# Altium project OSHChip_CMSIS_DAP_V1.0.PrjPCB
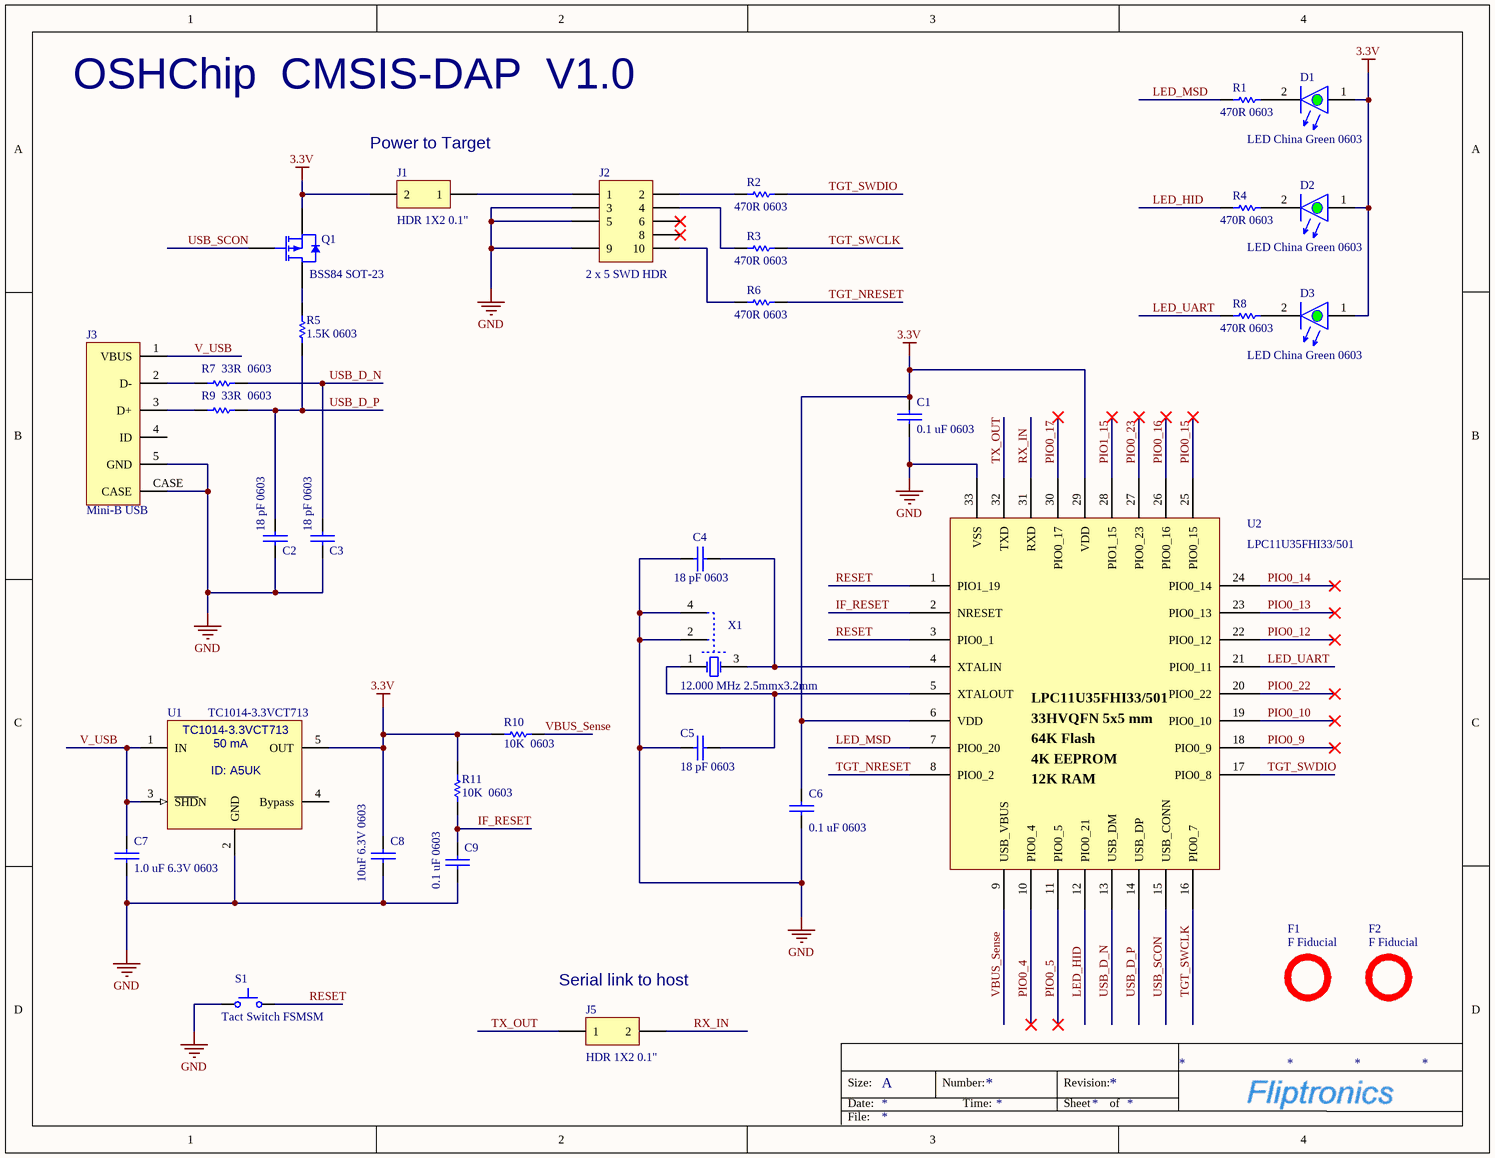
[diagram p0: OSHChip_CMSIS_DAP_V1.0.SchDoc]
Reference: OSHChip V1.0
1 sheet, 34 parts. Net scope: global (net labels, ports and power ports of the same name join across sheets).
Board file: OSHChip_CMSIS_DAP_V1.0.PcbDoc

## Sheet OSHChip_CMSIS_DAP_V1.0.SchDoc
size Letter; PageSetup: Record=PageOptions|CenterHorizontal=True|CenterVertical=True|PrintScale=1.07|XCorrection=1.00|YCorrection=1.00|PrintKind=1|BorderSize=5000000|LeftOffset=0|BottomOffset=0|Orientation=2|PaperLength=1000|PaperWidth=1000|Scale=100|PaperSource=260|PrintQuality=600|MediaType=1|DitherType=10|PaperKind=11x17|PrintScaleMode=0

### Parts
C1  0.1 uF 0603  [0603 Cap]
C2  18 pF 0603  [0603 Cap]
C3  18 pF 0603  [0603 Cap]
C4  18 pF 0603  [0603 Cap]
C5  18 pF 0603  [0603 Cap]
C6  0.1 uF 0603  [0603 Cap]
C7  1.0 uF 6.3V 0603  [0603 Cap]
C8  10uF 6.3V 0603  [0603 Cap]
C9  0.1 uF 0603  [0603 Cap]
D1  LED China Green 0603  [0603_LED]
D2  LED China Green 0603  [0603_LED]
D3  LED China Green 0603  [0603_LED]
F1  F Fiducial  [Fiducial Dot]  (no BOM)
F2  F Fiducial  [Fiducial Dot]  (no BOM)
J1  HDR 1X2 0.1"  [HDR_2X1_2MM54]
J2  2 x 5 SWD HDR  [HDR_2x5_1.27mm-Through_Hole_SWD No Shroud]
J3  Mini-B USB  [USB_Mini-B]
J5  HDR 1X2 0.1"  [HDR_2X1_2MM54]
Q1  BSS84 SOT-23  [SOT23-123]
R1  470R 0603  [0603 Res]
R2  470R 0603  [0603 Res]
R3  470R 0603  [0603 Res]
R4  470R 0603  [0603 Res]
R5  1.5K 0603  [0603 Res]
R6  470R 0603  [0603 Res]
R7  33R  0603  [0603 Res]
R8  470R 0603  [0603 Res]
R9  33R  0603  [0603 Res]
R10  10K  0603  [0603 Res]
R11  10K  0603  [0603 Res]
S1  Tact Switch FSMSM  [FSMSM Tact Switch]
U1  TC1014-3.3VCT713  [SOT23-5AL]
U2  LPC11U35FHI33/501  [LPC11U35 QFN32 footprint]
X1  12.000 MHz 2.5mmx3.2mm  [NX3225SA - High Density]

### Nets
3.3V: C1.2 C6.2 C8.2 D1.1 D2.1 D3.1 J1.2 Q1.2(S) R10.2 R11.2 U1.5(OUT) U2.6(VDD) U2.29(VDD)
GND: C1.1 C2.1 C3.1 C4.2 C5.2 C6.1 C7.1 C8.1 C9.1 J2.3 J2.5 J2.9 J3.5(GND) J3.CASE S1.1 U1.2(GND) U2.33(VSS) X1.2(nc_2) X1.4(nc_4)
IF_RESET: C9.2 R11.1 U2.2(NRESET)
LED_HID: R4.1 U2.12(PIO0_21)
LED_MSD: R1.1 U2.7(PIO0_20)
LED_UART: R8.1 U2.21(PIO0_11)
PIO0_4: U2.10(PIO0_4)
PIO0_5: U2.11(PIO0_5)
PIO0_9: U2.18(PIO0_9)
PIO0_10: U2.19(PIO0_10)
PIO0_12: U2.22(PIO0_12)
PIO0_13: U2.23(PIO0_13)
PIO0_14: U2.24(PIO0_14)
PIO0_15: U2.25(PIO0_15)
PIO0_16: U2.26(PIO0_16)
PIO0_17: U2.30(PIO0_17)
PIO0_22: U2.20(PIO0_22)
PIO0_23: U2.27(PIO0_23)
PIO1_15: U2.28(PIO1_15)
RESET: S1.2 U2.1(PIO1_19) U2.3(PIO0_1)
RX_IN: J5.2 U2.31(RXD)
TGT_NRESET: R6.2 U2.8(PIO0_2)
TGT_SWCLK: R3.2 U2.16(PIO0_7)
TGT_SWDIO: R2.2 U2.17(PIO0_8)
TX_OUT: J5.1 U2.32(TXD)
USB_D_N: C3.2 R7.2 U2.13(USB_DM)
USB_D_P: C2.2 R5.1 R9.2 U2.14(USB_DP)
USB_SCON: Q1.1(G) U2.15(USB_CONN)
V_USB: C7.2 J3.1(VBUS) U1.1(IN) U1.3(~{SHD}N)
VBUS_Sense: R10.1 U2.9(USB_VBUS)
NetC4_1: C4.1 U2.4(XTALIN) X1.3(OSC2)
NetC5_1: C5.1 U2.5(XTALOUT) X1.1(OSC1)
NetD1_2: D1.2 R1.2
NetD2_2: D2.2 R4.2
NetD3_2: D3.2 R8.2
NetJ1_1: J1.1 J2.1
NetJ2_2: J2.2 R2.1
NetJ2_4: J2.4 R3.1
NetJ2_10: J2.10 R6.1
NetJ3_2: J3.2(D-) R7.1
NetJ3_3: J3.3(D+) R9.1
NetQ1_3: Q1.3(D) R5.2

Not connected (* = marked no-connect by the designer): J2 6* 8*; J3 4(ID); U1 4(Bypass)

### Notes on the sheet
- OSHChip  CMSIS-DAP  V1.0
- (near J1) Power to Target
- (near J5) Serial link to host
- Size:
- Date:
- A
- Number:
- Time:
- Revision:
- Sheet
- of
- File:
- (in symbol U LPC11U35FHI33/501) 33HVQFN 5x5 mm; 64K Flash; 4K EEPROM; 12K RAM
- (in symbol U TC1014-3.3VCT713) 50 mA; ID: A5UK

### Library data of the parts
C1 C6 C9 = C 0.1 uF 16V 10% X7R 0603: 0.1 uF 16V 10% X7R 0603; Part Number: CC0603KRX7R7BB104; LatestRevisionDate: 06/29/2015; LatestRevisionNote: Created by PMF; Supplier 1: Digi-Key; Supplier Part Number 1: 311-1088-1-ND
C2-C5 = C 18 pF 0603  50V  NP0  5%: Capacitor 18 pF 0603  50V  NP0  5%; Part Number: CL10C180JB8NNNC; LatestRevisionDate: 06/29/2015; LatestRevisionNote: Created by PMF; Supplier 1: Digi-Key; Supplier Part Number 1: 1276-1089-1-ND
C7 = C 1.0 uF 6.3V 10% X7R 0603: Capacitor 1.0 uF 6.3V 10% X7R 0603; Part Number: CL10B105KQ8NNNC; LatestRevisionDate: 06/29/2015; LatestRevisionNote: Created by PMF; Supplier 1: Digi-Key; Supplier Part Number 1: 1276-1024-1-ND
C8 = C 10uF 0603 6.3V 20% X5R: Capacitor 10uF 0603 6.3V 20% X5R; Part Number: CL10A106MQ8NNNC; BOM Notes: < 100 pcs stock, check Verical for bulk.; LatestRevisionDate: 06/29/2015; LatestRevisionNote: Created by PMF; Supplier 1: Digi-Key; Supplier Part Number 1: 1276-1119-1-ND; Supplier 2: Digi-Key; Supplier Part Number 2: 490-6405-1-ND
D1-D3 = D LED LED_China_Green_0603: LED Green 0603; Part Number: ChinaLED_Green; BOM Notes: 'Check ebay, octoparts too. Parts from China at $0.014 each; LatestRevisionDate: 06/29/2015; LatestRevisionNote: Created by PMF; Supplier 1: China_ebay; Supplier Part Number 1: ChinaLED_Green
F1 F2 = F Fiducial: Fiducial; 1 MANUFACTURE A: Fliptronics; 1 MANUFACTURE A PART NUMBER: PCB_Artwork; 1 MANUFACTURE A WEBSITE: ~; 1 DISTRIBUTOR A: Fliptronics; 1 DISTRIBUTOR A ordering number: PCB_Artwork; 1 DISTRIBUTOR A price 1 off: 0.00; 1 DISTRIBUTOR A price 100 off: 0.00; LatestRevisionDate: 12/19/2011; LatestRevisionNote: Created by PMF; Publisher: Fliptronics; Supplier Part Number 1: PCB_Artwork; Supplier 1: Fliptronics
J1 J5 = J Header 1X2, 2.54 mm pitch: Header 1X2, 2.54 mm pitch; Part Number: M20-9990246; BOM Notes: Check Fliptronics stock. May require splitting longer strips.; LatestRevisionDate: 06/30/2015; LatestRevisionNote: Created by PMF; Supplier 1: Mouser; Supplier Part Number 1: 855-M20-9990246; Supplier 2: Newark; Supplier Part Number 2: 56K0146; Supplier 3: Digi-Key
J2 = J Header 5X2 J-Link Lite   FTSH-105-01-L-D through hole, No Key, No shroud: FTSH-105-01-L-D through hole, No Key, No shroud; BOM Notes: Check Fliptronics stock , equiv from China.; LatestRevisionDate: 06/30/2015; LatestRevisionNote: Created by PMF; Supplier 1: Newark; Supplier Part Number 1: 45P4907; Part Number: FTSH-105-01-L-D
J3 = J Mini-B USB 690-005-299-043 With alignment pins: USB 2.0, Right Angle, SMT, B Type, Receptacle, 5 Position, Black; BOM Notes: Part number is a place holder. Sourcing these via AliExpress.; LatestRevisionDate: 06/30/2015; LatestRevisionNote: Created by PMF; Supplier 1: Digi-Key; Supplier Part Number 1: 151-1206-1-ND; Part Number: 690-005-299-043
Q1 = Q BSS84: P-channel Enhancement Mode Vertical D-MOSFET; Part Number: BSS84,215; LatestRevisionDate: 06/30/2015; LatestRevisionNote: From Fairchild Lib; Supplier 1: Mouser; Supplier Part Number 1: 771-BSS84-T/R
R1-R4 R6 R8 = R 470R 0603 1/10 W 1%: Resistor 470R 0603 1/10 W 1%; Part Number: RC1608F471CS; LatestRevisionDate: 06/30/2015; LatestRevisionNote: Created by PMF; Supplier 1: Digi-Key; Supplier Part Number 1: 1276-4619-1-ND
R5 = R 1.5K 0603 1/10 W 1%: Resistor 1.5K 0402 1/10 W 1%; Part Number: RC0603FR-071K5L; LatestRevisionDate: 06/29/2015; LatestRevisionNote: Created by PMF; Supplier 1: Mouser; Supplier Part Number 1: 603-RC0603FR-071K5L; Supplier 2: Digi-Key; Supplier Part Number 2: 311-1.50KHRTR-ND
R7 R9 = R 33R 0603 1/10 W 1%: Resistor 33R 0603 1/10 W 1%; Part Number: MCR03ERTF33R0; LatestRevisionDate: 06/30/2015; LatestRevisionNote: Created by PMF; Supplier 1: Digi-Key; Supplier Part Number 1: RHM33.0CFCT-ND
R10 R11 = R 10K 0603 1/10 W 1%: Resistor 10K 0603 1/10 W 1%; Part Number: MCR03ERTF1002; LatestRevisionDate: 06/30/2015; LatestRevisionNote: Created by PMF; Supplier 1: Digi-Key; Supplier Part Number 1: RHM10.0KCFCT-ND
S1 = S FSMSM 6 x 3.5 mm   Tact Switch: 6 x 3.5 mm   Tact Switch; Part Number: FSMSMTR; BOM Notes: Check Octoparts and Sager; LatestRevisionDate: 06/30/2015; LatestRevisionNote: Created by PMF; Supplier 1: Digi-Key; Supplier Part Number 1: 450-1758-1-ND
U1 = U TC1014-3.3VCT713: 3.3V 50mA LDO; LatestRevisionDate: 06/30/2015; LatestRevisionNote: Created by PMF; BOM Notes: *; Supplier 1: Digi-Key; Supplier Part Number 1: TC1014-3.3VCT713CT-ND; Supplier 2: Mouser; Supplier Part Number 2: 579-TC1014-3.3VCT713; Part Number: TC1014-3.3VCT713
U2 = U LPC11U35FHI33/501: LPC11U35FHI33/501 ARM M0 64KB FLASH 33HVQFN; BOM Notes: Check with OctoParts: Verical; LatestRevisionDate: 06/30/2015; LatestRevisionNote: Created by PMF; Supplier 1: Newark; Supplier Part Number 1: 24W5342; Supplier 2: Digi-Key; Supplier Part Number 2: 568-9586-ND; Part Number: LPC11U35FHI33/501
X1 = X 12MHz, 2.5mmx3.2mm 30ppm 8 pF: 12MHz; Part Number: CX3225GB12000D0HEQCC; LatestRevisionDate: 06/30/2015; LatestRevisionNote: Created by PMF; BOM Notes: *; Supplier 1: Digi-Key; Supplier Part Number 1: 1253-1166-1-ND